# Altium schematic sheet DE-211024_3.SchDoc: RelayBoard
size A4; Author: eldar6776@hotmail.com; DrawnBy: Eldar Dedic; Organization: JUBERA d.o.o.; Address1: Braće Mulić 81; Address2: 71000 Sarajevo; Address3: Federacija BiH; Address4: Bosna i Hercegovina; DocumentNumber: DE-211024; Revision: 001; SheetNumber: 3; SheetTotal: 3; SPICEModelCacheBVBUIEPD: <root> / <DocumentId>BVBUIEPD</DocumentId> / </root>
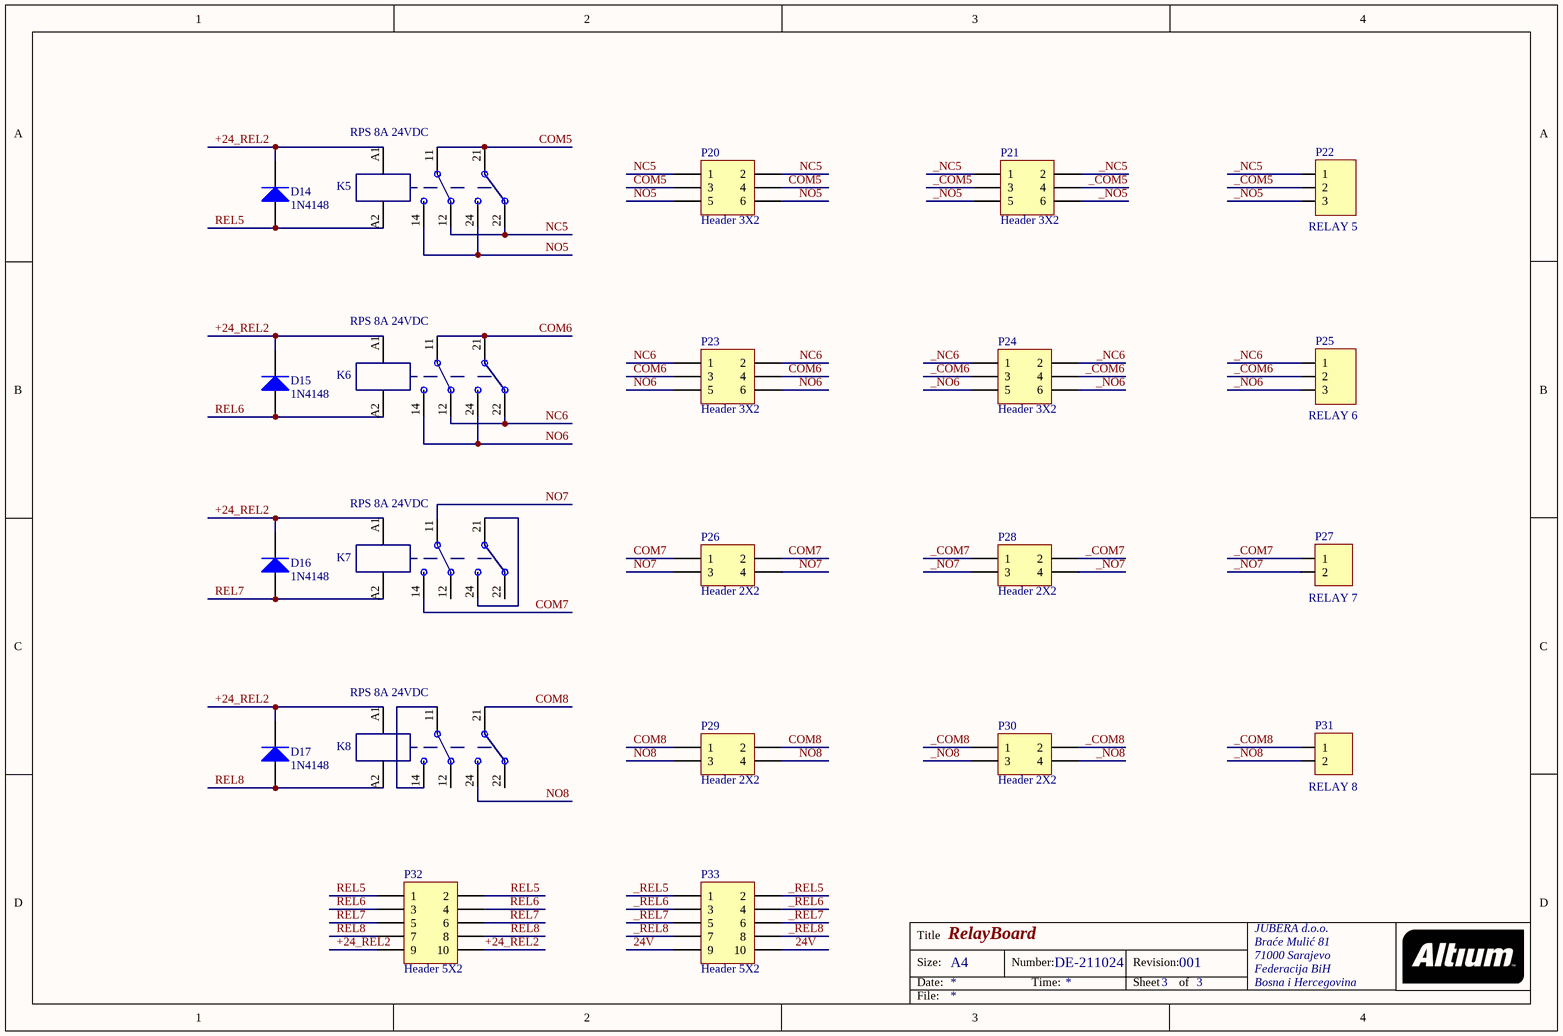
[diagram p0: DE-211024_3.SchDoc]

## Parts
D14  1N4148  [SOD323]
D15  1N4148  [SOD323]
D16  1N4148  [SOD323]
D17  1N4148  [SOD323]
K5  RPS 8A 24VDC  [RPS 2CO 8A 24V]
K6  RPS 8A 24VDC  [RPS 2CO 8A 24V]
K7  RPS 8A 24VDC  [RPS 2CO 8A 24V]
K8  RPS 8A 24VDC  [RPS 2CO 8A 24V]
P20  Header 3X2  [HDR2X3]
P21  Header 3X2  [HDR2X3]
P22  RELAY 5  [TERMINAL BLOK 3]
P23  Header 3X2  [HDR2X3]
P24  Header 3X2  [HDR2X3]
P25  RELAY 6  [TERMINAL BLOK 3]
P26  Header 2X2  [HDR2X2]
P27  RELAY 7  [TERMINAL BLOK 2]
P28  Header 2X2  [HDR2X2]
P29  Header 2X2  [HDR2X2]
P30  Header 2X2  [HDR2X2]
P31  RELAY 8  [TERMINAL BLOK 2]
P32  Header 5X2  [HDR2X5]
P33  Header 5X2  [HDR2X5]

## Nets
24V: P33.9 P33.10
+24_REL2: D14.1(K) D15.1(K) D16.1(K) D17.1(K) K5.A1 K6.A1 K7.A1 K8.A1 P32.9 P32.10
_COM5: P21.3 P21.4 P22.2
_COM6: P24.3 P24.4 P25.2
_COM7: P27.1 P28.1 P28.2
_COM8: P30.1 P30.2 P31.1
_NC5: P21.1 P21.2 P22.1
_NC6: P24.1 P24.2 P25.1
_NO5: P21.5 P21.6 P22.3
_NO6: P24.5 P24.6 P25.3
_NO7: P27.2 P28.3 P28.4
_NO8: P30.3 P30.4 P31.2
_REL5: P33.1 P33.2
_REL6: P33.3 P33.4
_REL7: P33.5 P33.6
_REL8: P33.7 P33.8
COM5: K5.11 K5.21 P20.3 P20.4
COM6: K6.11 K6.21 P23.3 P23.4
COM7: K7.14 P26.1 P26.2
COM8: K8.21 P29.1 P29.2
NC5: K5.12 K5.22 P20.1 P20.2
NC6: K6.12 K6.22 P23.1 P23.2
NO5: K5.14 K5.24 P20.5 P20.6
NO6: K6.14 K6.24 P23.5 P23.6
NO7: K7.11 P26.3 P26.4
NO8: K8.24 P29.3 P29.4
REL5: D14.2(A) K5.A2 P32.1 P32.2
REL6: D15.2(A) K6.A2 P32.3 P32.4
REL7: D16.2(A) K7.A2 P32.5 P32.6
REL8: D17.2(A) K8.A2 P32.7 P32.8
NetK7_21: K7.21 K7.24
NetK8_11: K8.11 K8.14

Not connected (* = marked no-connect by the designer): K7 12(5) 22(5); K8 12(5) 22(5)

## Notes on the sheet
- Title
- Size:
- Date:
- A4
- Number:
- Time:
- Revision:
- Sheet
- of
- File:

## Library data of the parts
D14-D17 = BAS321: General-purpose Diode; Published: 17-Sep-2003; LatestRevisionDate: 19-Mar-2004; LatestRevisionNote: Silkscreen size reduced.; DatasheetVersion: 9-Feb-1999; PackageVersion: May-1999; PackageReference: SOD323; Publisher: Altium Limited; PackageDescription: SOD-323/SC-76; 2 Leads; Body 1.7 x 1.3 mm, (LxW); ComponentLink1Description: Manufacturer Link; ComponentLink1URL: http://www.semiconductors.philips.com/; ComponentLink2Description: Datasheet; ComponentLink2URL: http://www.semiconductors.philips.com/acrobat/datasheets/BAS321_2.pdf
K5-K8 = PCB relay 2CO, 8A, 24VDC, RPS serie 5mm
P20 P21 P23 P24 = Header 3X2: Header, 3-Pin, Dual row; LatestRevisionDate: 17-Jul-2002; LatestRevisionNote: Re-released for DXP Platform.; Publisher: Altium Limited
P22 P25 = TERMINAL BLOK 3: 3 pinski terminal blok konektor
P26 P28-P30 = Header 2X2: Header, 2-Pin, Dual row; LatestRevisionDate: 17-Jul-2002; LatestRevisionNote: Re-released for DXP Platform.; Publisher: Altium Limited
P27 P31 = TERMINAL BLOK 2: Terminal blok konektor 3,5 mm
P32 P33 = Header 5X2: Header, 5-Pin, Dual row; LatestRevisionDate: 17-Jul-2002; LatestRevisionNote: Re-released for DXP Platform.; Publisher: Altium Limited